# EAGLE design Adafruit 555 PWM Output STEMMA (EAGLE 9.6.2)
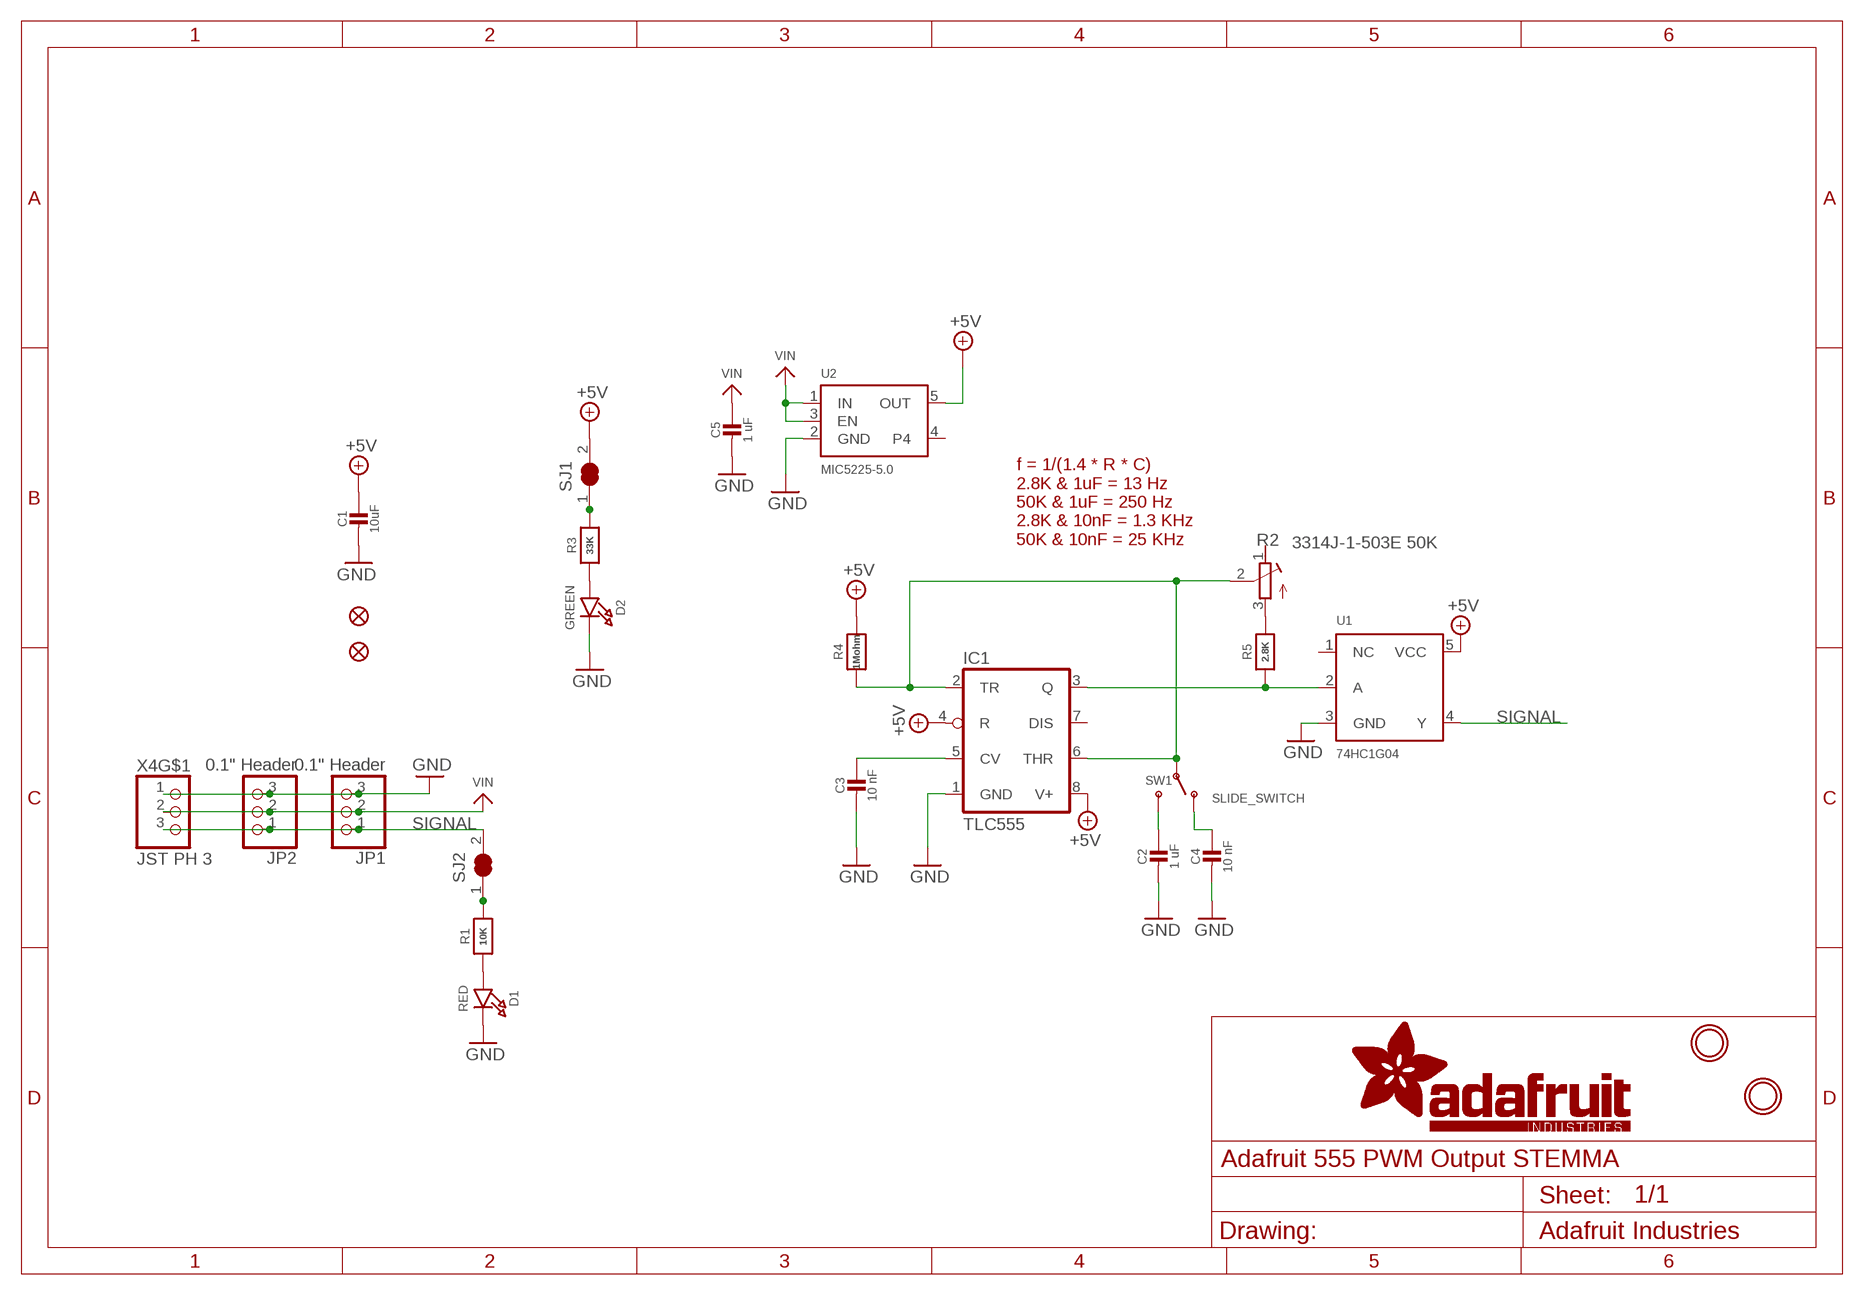
[diagram p0: schematic, sheet 1]

## Parts
C1  10uF  CAP_CERAMIC0805-NOOUTLINE  [0805-NO]
C2  1 uF  CAP_CERAMIC0603_NO  [0603-NO]
C3  10 nF  CAP_CERAMIC0603_NO  [0603-NO]
C4  10 nF  CAP_CERAMIC0603_NO  [0603-NO]
C5  1 uF  CAP_CERAMIC0603_NO  [0603-NO]
D1  RED  LED0603_NOOUTLINE  [CHIPLED_0603_NOOUTLINE]
D2  GREEN  LED0603_NOOUTLINE  [CHIPLED_0603_NOOUTLINE]
FID2  FIDUCIAL_1MM  [FIDUCIAL_1MM]
FID3  FIDUCIAL_1MM  [FIDUCIAL_1MM]
IC1  TLC555  LM555D  [SO08]
JP1  0.1" Header  HEADER-1X3  [1X03_OVAL]
JP2  0.1" Header  HEADER-1X3ROUND  [1X03_ROUND]
R1  10K  RESISTOR_0603_NOOUT  [0603-NO]
R2  3314J-1-503E 50K  R-TRIMM3314J  [RTRIM3314J]
R3  33K  RESISTOR_0603_NOOUT  [0603-NO]
R4  1Mohm  RESISTOR_0603_NOOUT  [0603-NO]
R5  2.8K  RESISTOR_0603_NOOUT  [0603-NO]
SJ1  SOLDERJUMPER_CLOSED  [SOLDERJUMPER_CLOSEDWIRE]
SJ2  SOLDERJUMPER_CLOSED  [SOLDERJUMPER_CLOSEDWIRE]
SW1  SLIDE_SWITCH  SWITCH_SPDT  [SPDT_SMT_SSSS811101]
U1  74HC1G04  74LVC1G04SC-70  [SC70-5]
U2  MIC5225-5.0  VREG_SOT23-5  [SOT23-5]
U$1  MOUNTINGHOLE2.5  [MOUNTINGHOLE_2.5_PLATED]
U$8  MOUNTINGHOLE2.5  [MOUNTINGHOLE_2.5_PLATED]
X4  JST PH 3  CON_JST_PH_3PIN  [JSTPH3]

## Nets
+5V: C1.1 IC1.4(R) IC1.8(V+) R4.2 SJ1.2 U1.5(VCC) U2.5(OUT)
GND: C1.2 C2.2 C3.2 C4.2 C5.2 D1.C D2.C IC1.1(GND) JP1.3 JP2.3 U1.3(GND) U2.2(GND) X4.1
N$1: R3.2 SJ1.1
N$2: D1.A R1.1
N$3: R1.2 SJ2.1
N$4: C2.1 SW1.C(S)
N$5: IC1.2(TR) IC1.6(THR) R2.2(S) R4.1 SW1.B(P)
N$6: C3.1 IC1.5(CV)
N$7: C4.1 SW1.A(O)
N$8: R2.3(A) R5.2
N$10: IC1.3(Q) R5.1 U1.2(A)
N$26: D2.A R3.1
SIGNAL: JP1.1 JP2.1 SJ2.2 U1.4(Y) X4.3
VIN: C5.1 JP1.2 JP2.2 U2.1(IN) U2.3(EN) X4.2
Unconnected: IC1.7(DIS) R2.1(E) U1.1(NC) U2.4 X4.NC1(MT) X4.NC2(MT)

## Notes on the sheet
- f = 1/(1.4 * R * C)
  2.8K & 1uF = 13 Hz
  50K & 1uF = 250 Hz
  2.8K & 10nF = 1.3 KHz
  50K & 10nF = 25 KHz

## Library data of the parts
C1-C5 = microbuilder:CAP_CERAMIC: Ceramic Capacitors For new designs, use the packages preceded by an '_' character since they are more reliable: The following footprints should be used on most boards: _0402 - Standard footprint for regular board layouts _0603 - Standard footprint for regular board layouts _0805 - Standard footprint for regular board layouts _1206 - Standard footprint for regular board layouts For extremely tight-pitch boards where space is at a premium, the following 'micro-pitch' footprints can be used (smaller pads, no silkscreen outline, etc.): _0402MP - Micro-pitch footprint for very dense/compact boards _0603MP - Micro-pitch footprint for very dense/compact boards _0805MP - Micro-pitch footprint for very dense/compact boards _1206MP - Micro-pitch footprint for very dense/compact boards
D1 D2 = microbuilder:LED: LED 0603 - 0603 Surface Mount Package 2mA: Green LED - Low Power (3.9mcd, 2ma, 1.7Vf) - Digikey: 475-2709-2-ND Orange LED - Low Power (9.8mcd, 2ma, 1.8Vf) - Digikey: 475-1194-2-ND Red LED - Low Power (5mcd, 2ma, 1.8Vf) - Digikey: 475-1195-2-ND Yellow LED - Low Power (7mcd, 2ma, 1.8Vf) - Digikey: 475-1196-2-ND 5mA: Blue LED - Low Power (17mcd, 5ma, 2.9Vf) - Digikey: LNJ937W8CRACT-ND 0805 - 0805 Surface Mount Package 2mA: Red LED (8.8mcd, 2mA, 1.8Vf, Clear) - Low Power [Digikey: 475-2510-1-ND] Green LED (5mcd, 2mA, 1.8Vf, Clear) - Low Power [Digikey: 475-2730-1-ND] Yellow LED (11.3mcd, 2mA, 1.8Vf, Clear) - Low Power [Digikey: 475-2555-1-ND] 20mA: Red LED (104mcd, 20mA, Diffused) - LS R976 [Digikey: 475-1278-6-ND] Red LED (12mcd, 20mA, 2.0Vf, Clear) - APT2012EC [Digikey: 754-1128-1-ND] Green LED (15mcd, 20mA, 2.2Vf, Clear) - APT2012GC [Digikey: 754-1131-1-ND] Orange LED (160mcd, 20mA, 2.1Vf, Clear) - APT2012SECK [Digikey: 754-1130-1-ND] 1206 - 1206 Surface Mount Package Green LED (26mcd, 20mA, Diffused) - LG N971 [Digikey: 475-1407-6-ND] Red LED (15mcd, 20mA, Diffused) - LH N974 [Digikey: 475-1416-6-ND] Cree - Cree High-Power Surface Mount LEDs XPEBWT-L1-0000-00D50 - White 111lm 350mA 2.9Vf 6200K 110° XTEAWT-00-0000-00000LEE3 - White 114lm 350mA 2.85Vf 5000K 115° Everlight - Everlight 45-21 Series Surface Mount LEDs 45-21/QK2C-B2832AC2CB2/2T - Warm White 2000mcd 20mA 3.25Vf 3050K 120° 45-21/LK2C-B38452C4CB2/2T - Nuetral White 2000mcd 20mA 3.25Vf 4150K 120° 45-21/LK2C-B50634C6CB2/2T - Cold White 2200mcd 20mA 3.25Vf 5650K 120° PLCC2 Reverse Mount LS T77K-J1L2-1-0-2-R18-Z - Red 11.25mcd 2mA 1.8Vf 630nm 120° LO T77K-L1M2-24-Z - Orange 19.6mcd 2mA 1.8Vf 606nm 120° LY T77K-K2M1-26-Z - Yellow 15.7mcd 2mA 1.8Vf 587nm 120°; ROT: 270
FID2 FID3 = microbuilder:FIDUCIAL: Fiducial Alignment Points Various fiducial points for machine vision alignment.; BOM: EXCLUDE
IC1 = adafruit:*555: TIMER Changed DIP package to have round (not oval) pin pads http://www.ladyada.net/library/pcb/eaglelibrary.html
JP1 JP2 = microbuilder:HEADER-1X3: PIN HEADER
R1 R3-R5 = microbuilder:RESISTOR: Resistors For new designs, use the packages preceded by an '_' character since they are more reliable: The following footprints should be used on most boards: _0402 - Standard footprint for regular board layouts _0603 - Standard footprint for regular board layouts _0805 - Standard footprint for regular board layouts _1206 - Standard footprint for regular board layouts For extremely tight-pitch boards where space is at a premium, the following 'micro-pitch' footprints can be used (smaller pads, no silkscreen outline, etc.): _0402MP - Micro-pitch footprint for very dense/compact boards _0603MP - Micro-pitch footprint for very dense/compact boards _0805MP - Micro-pitch footprint for very dense/compact boards _1206MP - Micro-pitch footprint for very dense/compact boards
R2 = adafruit_electromech:R-TRIMM: Trimm resistor; SPICEMODEL: X; SPICEPREFIXL: POT
SJ1 SJ2 = microbuilder:SOLDERJUMPER_CLOSED: Solder Jumper - Closed These solder jumpers are closed by default CLOSEDWIRE - 10 mil trace between pads that can be cut and resoldered later CLOSEDPERM - 63 mil trace between pads for a permanent connection (used to 'bridge' two signals, a shameless hack for Eagle). Can double as a test point as well (no cream layer)
SW1 = adafruit_electromech:SWITCH_SPDT: Switch - SPDT SSSS811101 - Horizontal Two Position SMT, 0.3A 4V [Mouser: 688-SSSS811101]
U1 = microbuilder:74LVC1G04: 74LVC1G04 - Single Inverter Gate SOT23-5 SN74LVC1G04DBVR - Digikey: 296-11599-1-ND
U2 = adafruit_power:VREG_SOT23-5: SOT23-5 Fixed Voltage Regulators Part Current Out V Out V In V Dropout θJA (°C/W) TJ (°C) Digikey Part No. ADP121 150mA 3.3V 3.4-5.5V 0.09V @ 150mA -- -- ADP121-AUJZ33R7CT-ND ADP121 150mA 3.0V 3.1-5.5V 0.09V @ 150mA -- -- ADP121-AUJZ30R7CT-ND ADP122 300mA 3.3V 3.4-5.5V 0.085V @ 300mA -- -- ADP122AUJZ-3.3-R7CT-ND ADP1712 300mA 3.3V 3.5-5.5V 0.17V @ 300mA -- -- ADP1712AUJZ-3.3-R7TR-ND AP7311 (Low Cost) 150mA 3.3V 3.5-6V 0.15V @ 150mA -- -- AP7311-33WG-7DICT-ND LD39015M18R 150mA 1.8V 1.9V-5.5V 0.08V @ 100mA -- -- 497-6977-1-ND LP2985A-33DBVR 150mA 3.3V 3.3-16V 0.28V @ 150mA 206 150 296-18479-1-ND MCP1824T-3302E/OT 300mA 3.3V 3.5V-6V 0.2V @ 300mA -- -- MCP1824T-3302E/OTCT-ND MIC5205-2.5YM5 TR 150mA 2.5V 2.7-16V 0.165V @ 150mA -- -- 576-1257-2-ND MIC5205-3.0YM5 TR 150mA 3.0V 3.2V-16V 0.165V @ 150mA -- -- 576-1258-2-ND MIC5205-3.3YM5 TR 150mA 3.3V 3.5V-16V 0.165V @ 150mA -- -- 576-1259-2-ND TPS780330220 150mA 3.3V+2.2V 3.6-5.5V 250mV Max -- -- 296-23332-1-ND TDA3663/N1,135 100mA 3.3V 3.5-45V 0.18V @ 50mA -- -- 568-5343-1-ND Max operating temp can be calculated using θJA, TJ (max junction temperature), and power in watts. Set the "Maximum Ambient Temperature" until it reaches TJ ("Max Junction Temperature"), which is the absolute limit for safe use of the regulator: Heat Sink Temperature Calculator <http://www.daycounter.com/Calculators/Heat-Sink-Temperature-Calculator.phtml> For example, With 12V source into a 3.3V LP2985 and a 30mA load, we are dissipating (12V-3.3V) * 0.03A = 0.261W. With a θJA of 206 °C/W, a TJ of 150°C, and 261mW we can safely use the chip without a heat sink up to 75°C (=147.1°C Junction Temperature).; JLC_ROTATION: 270
U$1 U$8 = adafruit_electromech:MOUNTINGHOLE: Mounting Hole For #2 screws (0.086"/2.18mm width, 0.094"/2.4mm hole) use 2.5mm; BOM: EXCLUDE
X4 = adafruit_electromech:CON_JST_PH_3PIN

## Net classes
1 HV: width 0.406 mm, drill 0.381 mm, clearance 0.762 mm

## Board
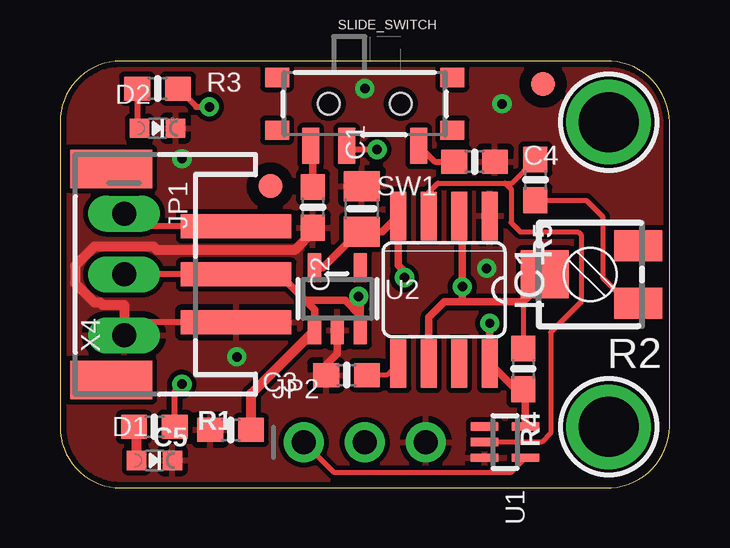
[diagram p1: board, top side]
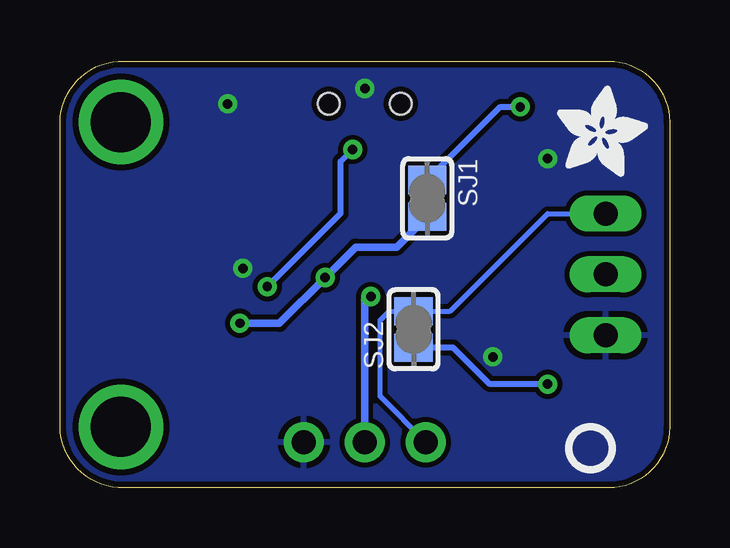
[diagram p2: board, bottom side, seen from below]

Size 25.4 x 17.78 mm. Coordinates in mm from the lower left corner, seen from the top.
Outline: 0,15.24 0,2.54 arc90 2.54,0 22.73,0 arc90 25.4,2.54 25.4,15.24 arc90 22.73,17.78 2.54,17.78 arc90 0,15.24
Copper layers (1*16): Top 0.035mm / dielectric 1.5mm / Bottom 0.035mm
Design rules "adafruit": minimum track width 8mil, minimum drill 15.5mil, track to track 8mil, track to pad 8mil, pad to pad 8mil, via to via 8mil, smd to smd 8mil, copper to edge 10mil, drill to drill 8mil, minimum pad ring 10mil, minimum via ring 8mil, stop-mask expansion 2mil, vias tented up to drill 20mil, thermal gap 10mil

### Footprints (pad centres in the part's own frame; a part is rotated, then mirrored left to right if it is on the bottom)
0805-NO = smd 1.24 x 1.5: 1 -0.95,0; 2 0.95,0
0603-NO = smd 1.075 x 1: 1 -0.85,0; 2 0.85,0
CHIPLED_0603_NOOUTLINE = smd 0.8 x 0.8: A 0,-0.75; C 0,0.75
FIDUCIAL_1MM = smd 1 x 1: 1 0,0
SO08 = smd 0.66 x 2.032: 1 -1.905,-3.073; 2 -0.635,-3.073; 3 0.635,-3.073; 4 1.905,-3.073; 5 1.905,3.073; 6 0.635,3.073; 7 -0.635,3.073; 8 -1.905,3.073
1X03_OVAL = drill 1 long: 1 -2.54,0; 2 0,0; 3 2.54,0
1X03_ROUND = drill 1 pad 1.676: 1 -2.54,0; 2 0,0; 3 2.54,0
RTRIM3314J = smd 1.3 x 2: 1 1.2,-2; 3 -1.2,-2 | smd 2 x 2: 2 0,1.9
SOLDERJUMPER_CLOSEDWIRE = smd 1.168 x 1.6: 1 -0.762,0; 2 0.762,0 | smd 0.635 x 0.203: WIRE 0,0
SPDT_SMT_SSSS811101 = smd 0.7 x 1.5: A -2.25,1.242; B 0.75,1.242; C 2.25,1.242 | smd 1 x 0.8: SUP1 -3.65,0.592; SUP2 -3.65,-1.608; SUP3 3.65,0.592; SUP4 3.65,-1.608 | hole 0.9: -1.5,-0.508; 1.5,-0.508
SC70-5 = smd 0.35 x 1.15: 1 -0.65,-0.85; 2 0,-0.85; 3 0.65,-0.85; 4 0.65,0.85; 5 -0.65,0.85
SOT23-5 = smd 0.55 x 1.2: 1 -0.95,-1.3; 2 0,-1.3; 3 0.95,-1.3; 4 0.95,1.3; 5 -0.95,1.3
MOUNTINGHOLE_2.5_PLATED = drill 2.5 pad 3.2: P$1 0,0
JSTPH3 = smd 1 x 4.6: 1 -2,-2.7; 2 0,-2.7; 3 2,-2.7 | smd 1.6 x 3.4: NC1 -4.4,2.5; NC2 4.4,2.5

### Placement (x,y rotation side)
C1  12.57,11.62 90 top
C2  10.54,11.68 270 top
C3  11.94,4.7 180 top
C4  17.27,13.59 0 top
C5  7.11,2.41 180 top
D1  3.94,1.14 270 top
D2  4.06,14.99 270 top
FID2  8.76,12.57 0 top
FID3  20.13,16.83 0 top
IC1  16,8.26 180 top
JP1  2.67,8.89 270 top
JP2  12.7,1.91 0 top
PLABEL0  [PLABEL0]  2.29,14.61 90 top
PLABEL1  [PLABEL1]  2.03,1.02 90 top
PLABEL7  [PLABEL7]  4.45,11.43 0 bottom
PLABEL8  [PLABEL8]  4.19,8.89 0 bottom
PLABEL9  [PLABEL9]  4.32,6.35 0 bottom
PLABEL13  [PLABEL13]  9.65,3.56 0 top
PLABEL14  [PLABEL14]  12.45,3.56 0 top
PLABEL15  [PLABEL15]  15.88,3.56 0 top
PLABEL19  [PLABEL19]  11.68,8.76 0 bottom
PLABEL20  [PLABEL20]  11.18,13.97 0 bottom
PLABEL21  [PLABEL21]  5.71,14.61 0 top
PLABEL22  [PLABEL22]  17.02,14.73 0 top
PLABEL23  [PLABEL23]  20.7,11.81 0 top
PLABEL24  [PLABEL24]  20.07,4.95 0 top
PLABEL25  [PLABEL25]  25.27,4.32 0 bottom
PLABEL26  [PLABEL26]  21.08,2.92 0 bottom
R1  3.94,2.54 0 top
R2  22.1,8.89 90 top
R3  4.06,16.64 0 top
R4  19.3,4.95 270 top
R5  19.81,12.83 270 top
SJ1  10.1,12.06 270 bottom
SJ2  10.67,6.6 90 bottom
SW1  12.7,15.49 180 top
U1  18.54,1.91 270 top
U2  11.56,7.87 0 top
U$1  22.86,2.54 0 top
U$5  [PCBFEAT-REV-040]  3.3,1.65 180 bottom
U$8  22.86,15.24 0 top
U$15  [ADAFRUIT_3.5MM]  4.7,12.95 0 bottom
X4  4.64,8.89 90 top

### Tracks (layer width: path | path; a pad name or v marks a point on that pad's centre or on a via)
+5V  (via drill 0.39)
  Top 0.305: U1.5 19.39,4.01 R4.2 18.99,4.1 IC1.8 v17.91,6.86 | U2.5 10.95,9.17 12.45,10.67 C1.1 13.44,10.67 IC1.4 14.1,9.27 14.48,8.89 v14.35,8.76
  Bottom 0.305: SJ1.2 11.37,10.03 13.08,10.03 v14.35,8.76 16.26,6.86 v17.91,6.86
GND  (via drill 0.39)
  Top 0.254: X4.1 3.21,6.89 JP1.3
  Top 0.305: U2.2 11.56,5.59 11.09,5.12 C3.2
  Top 0.406: C2.2 10.54,10.67 9.78,9.91 4.05,9.91 3.9,10.05 1.43,10.05 0.64,9.25 0.64,8.53 1.43,7.73 1.67,7.73 1.78,7.62 2.67,7.62 JP1.3
  other vias: 18.41,16 5.08,13.72 7.37,5.46 12.7,16.64 17.78,9.14
  pour Top: 0,17.78 25.4,17.78 25.4,0 0,0
  pour Bottom: 0,17.78 25.4,17.78 25.4,0 0,0
N$1  (via drill 0.39)
  Top 0.254: R3.2 5.68,15.88 v6.22,15.88
  Bottom 0.254: v6.22,15.88 7.05,15.88 SJ1.1
N$2
  Top 0.406: R1.1 3.19,2.44 D1.A
N$3  (via drill 0.39)
  Top 0.254: R1.2 4.79,4.03 v5.08,4.32
  Bottom 0.254: v5.08,4.32 7.49,4.32 9.02,5.84 SJ2.1
N$4
  Top 0.305: SW1.C 10.41,14.22 10.54,14.18 C2.1
N$5  (via drill 0.39)
  Top 0.203: 19.3,7.75 R4.1
  Top 0.254: v13.21,14.1 12.11,14.1 SW1.B
  Top 0.305: IC1.6 15.37,7.11 16,7.75 16.76,7.75 | 16.76,7.75 19.3,7.75 20.2,8.64 R2.2 | IC1.2 16.76,11.2 v16.76,8.38 16.76,7.75
  Bottom 0.254: v13.21,14.1 13.72,13.59 13.72,11.43 v16.76,8.38
N$6
  Top 0.203: IC1.5 13.61,4.7 C3.1
N$7
  Top 0.254: SW1.A 15.61,13.59 C4.1
N$8
  Top 0.203: R2.3 23.68,7.69 22.61,8.76 22.61,11.3 21.93,11.98 R5.2
N$10
  Top 0.203: IC1.3 15.37,12.32 15.75,12.7 18.54,12.7 | R5.1 18.84,12.7 18.54,12.7 | 18.54,12.7 18.8,12.45 18.8,11.05 19.18,10.67 21.59,10.67 21.72,10.54 21.72,7.75 20.45,6.48 20.45,2.29 20.07,1.91 U1.2
N$26
  Top 0.254: R3.1 3.21,15.09 D2.A
SIGNAL
  Top 0.203: U1.4 18.77,0.64 11.43,0.64 JP2.1
  Top 0.254: X4.3 3.21,10.89 JP1.1
  Bottom 0.203: JP2.1 12.06,3.81 12.06,6.99 11.68,7.37 SJ2.2 9.14,7.37 5.08,11.43 JP1.1
VIN  (via drill 0.39)
  Top 0.254: X4.2 JP1.2
  Top 0.305: U2.1 10.61,7.43 10.23,7.81 | X4.2 9.14,8.89 10.23,7.81 | 10.23,7.81 11.88,7.81 12.51,7.18 | 12.51,7.18 U2.3 | v12.45,7.97 12.51,7.91 12.51,7.18
  Top 0.406: U2.1 7.96,3.93 C5.1
  Bottom 0.305: JP2.2 12.7,7.97 v12.45,7.97

### Text on the board
Pinguin_tBackup: 250 / Hz | 25 / KHz | Freq. | Adjust
Pinguin_bBackup: 555 PWM Out / Adj. Range: / 15~250 Hz / 1.5K~25 KHz | Vin:3~12VDC Vout: 3~5V